# Altium schematic sheet Slave_Board_Sch.SchDoc
size A; SheetNumber: 1; SheetTotal: 1
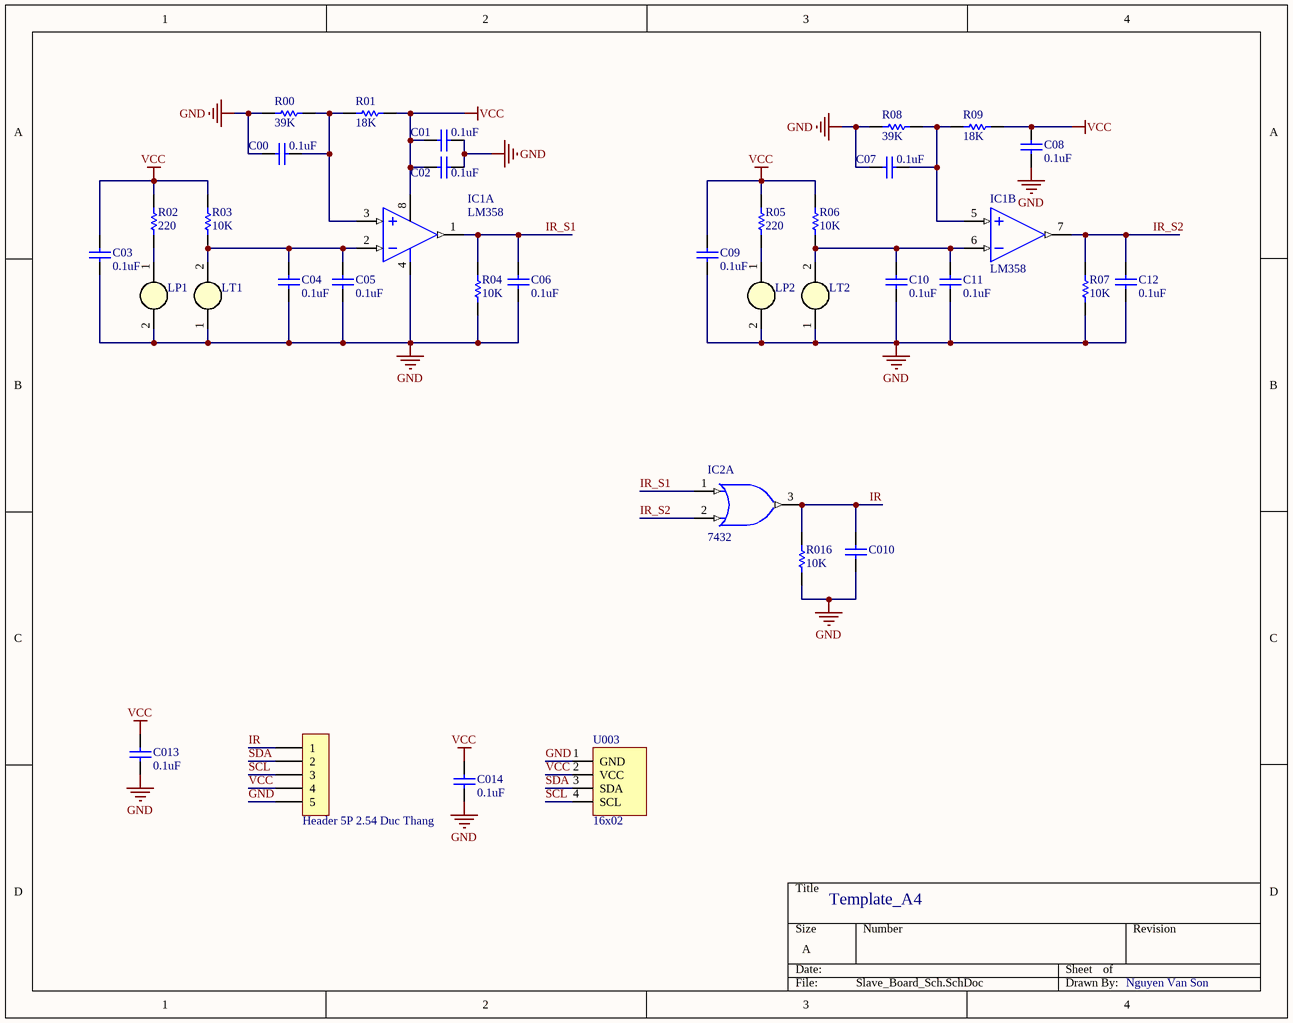
[diagram p0: Slave_Board_Sch.SchDoc]

## Parts
C00  value 0.1uF  [CAP-SM-0603]  (hidden comment: Cap Non-Pol SMD)
C01  value 0.1uF  [CAP-SM-0603]  (hidden comment: Cap Non-Pol SMD)
C02  value 0.1uF  [CAP-SM-0603]  (hidden comment: Cap Non-Pol SMD)
C03  value 0.1uF  [CAP-SM-0603]  (hidden comment: Cap Non-Pol SMD)
C04  value 0.1uF  [CAP-SM-0603]  (hidden comment: Cap Non-Pol SMD)
C05  value 0.1uF  [CAP-SM-0603]  (hidden comment: Cap Non-Pol SMD)
C06  value 0.1uF  [CAP-SM-0603]  (hidden comment: Cap Non-Pol SMD)
C07  value 0.1uF  [CAP-SM-0603]  (hidden comment: Cap Non-Pol SMD)
C08  value 0.1uF  [CAP-SM-0603]  (hidden comment: Cap Non-Pol SMD)
C09  value 0.1uF  [CAP-SM-0603]  (hidden comment: Cap Non-Pol SMD)
C010  Cap Non-Pol SMD  [CAP-SM-0603]  (value not drawn)
C10  value 0.1uF  [CAP-SM-0603]  (hidden comment: Cap Non-Pol SMD)
C11  value 0.1uF  [CAP-SM-0603]  (hidden comment: Cap Non-Pol SMD)
C12  value 0.1uF  [CAP-SM-0603]  (hidden comment: Cap Non-Pol SMD)
C013  value 0.1uF  [CAP-SM-0603]  (hidden comment: Cap Non-Pol SMD)
C014  value 0.1uF  [CAP-SM-0603]  (hidden comment: Cap Non-Pol SMD)
IC1  LM358  [SO8]  (parts A,B of 2)
IC2  7432  [SO14]  (part A of 4)
J001  Header 5P 2.54 Duc Thang  [XH2.54M-5]
LP1  LED 5mm  [LED-5MM-WHITE]  (value not drawn)
LP2  LED 5mm  [LED-5MM-WHITE]  (value not drawn)
LT1  LED 5mm  [LED-5MM-WHITE]  (value not drawn)
LT2  LED 5mm  [LED-5MM-WHITE]  (value not drawn)
R00  value 39K  [RES-SM-0603]  (hidden comment: RESISTOR SMD)
R01  value 18K  [RES-SM-0603]  (hidden comment: RESISTOR SMD)
R02  value 220  [RES-SM-0603]  (hidden comment: RESISTOR SMD)
R03  value 10K  [RES-SM-0603]  (hidden comment: RESISTOR SMD)
R04  value 10K  [RES-SM-0603]  (hidden comment: RESISTOR SMD)
R05  value 220  [RES-SM-0603]  (hidden comment: RESISTOR SMD)
R06  value 10K  [RES-SM-0603]  (hidden comment: RESISTOR SMD)
R07  value 10K  [RES-SM-0603]  (hidden comment: RESISTOR SMD)
R08  value 39K  [RES-SM-0603]  (hidden comment: RESISTOR SMD)
R09  value 18K  [RES-SM-0603]  (hidden comment: RESISTOR SMD)
R016  value 10K  [RES-SM-0603]  (hidden comment: RESISTOR SMD)
U003  16x02  [LCD&I2c]

## Nets
GND: C00.1 C01.2 C02.2 C03.2 C04.2 C05.2 C06.2 C07.2 C08.2 C09.2 C010.2 C10.2 C11.2 C12.2 C013.2 C014.2 IC1.4(-V) IC2.7(GND) J001.5 LP1.2(K) LP2.2(K) LT1.1(A) LT2.1(A) R00.1 R04.1 R07.1 R08.1 R016.1 U003.1(GND)
VCC: C01.1 C02.1 C03.1 C08.1 C09.1 C013.1 C014.1 IC1.8(+V) IC2.14(VCC) J001.4 R01.2 R02.2 R03.2 R05.2 R06.2 R09.2 U003.2(VCC)
IR: C010.1 IC2.3(Y) J001.1 R016.2
IR_S1: C06.1 IC1.1(OUT) IC2.1(A) R04.2
IR_S2: C12.1 IC1.7(OUT) IC2.2(B) R07.2
SCL: J001.3 U003.4(SCL)
SDA: J001.2 U003.3(SDA)
NetC00_2: C00.2 IC1.3(IN+) R00.2 R01.1
NetC04_1: C04.1 C05.1 IC1.2(IN-) LT1.2(K) R03.1
NetC07_1: C07.1 IC1.5(IN+) R08.2 R09.1
NetC10_1: C10.1 C11.1 IC1.6(IN-) LT2.2(K) R06.1
NetLP1_1: LP1.1(A) R02.1
NetLP2_1: LP2.1(A) R05.1

## Notes on the sheet
- Template_A4
- Nguyen Van Son

## Library data of the parts
C00 C01 C02 C03 C04 C05 C06 C07 C08 C09 C010 C10-C12 C013 C014 = Cap Non-Pol SMD: Capacitor
IC1 = LM358: Low-Power Dual Operational Amplifier; Value: LM358
IC2 = 7432: Quad 2-Input OR Gate
J001 = Header 5P 2.54 Duc Thang: Cắm; Ten_Linh_Kien: Header 5P XH2.54-5P Đực Thẳng; Don_Vi: Con; Ma_Hang: MH001298; Chung_Loai: Cắm
LP1 LP2 LT1 LT2 = LED 5mm Trang: Cắm; Don_Vi: Con; Ma_Hang: MH008983; Ten_Linh_Kien: Led 5MM Trắng Đục (1000c); Ghi_Chu: *; Kieu_Chan: *; Chung_Loai: Cắm
R00 R01 R02 R03 R04 R05 R06 R07 R08 R09 R016 = RESISTOR SMD: Resistor
U003 = LCD&I2C